# EAGLE schematic SerLCD_16x2_PM-v01 (EAGLE 7.6.0)
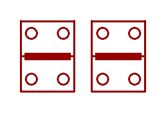
[diagram p0: schematic, sheet 1]

## Parts
U$6  GOLD_HINDGEPM+PF  [GOLD_HINGE_PM]
U$7  GOLD_HINDGEPM+PF  [GOLD_HINGE_PM]

## Library data of the parts
U$6 U$7 = Testing:GOLD_HINDGE

## Net classes
1 vcc1: width 0.203 mm
3 VCC2: width 0.381 mm, drill 0.508 mm, clearance 0.254 mm to class 0
8 eight_mil: width 0.203 mm, clearance 0.127 mm
9 twelve_mil: width 0.305 mm, clearance 0.127 mm
10 twenty_mil: width 0.508 mm, clearance 0.127 mm
11 thirty_mil: width 0.762 mm, clearance 0.127 mm
13 20_mil: width 0.508 mm, drill 0.508 mm